# Altium project MMP8266.PrjPcb
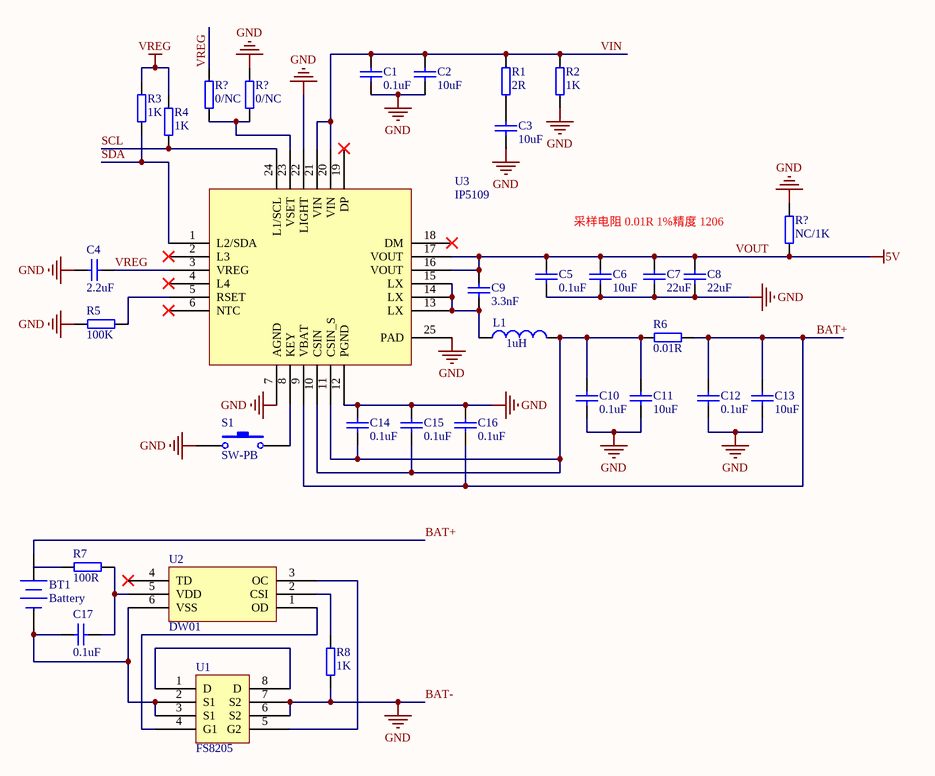
[diagram p0: MMP8266_PowerManage.SchDoc]
2 sheets, 34 parts. Net scope: global (net labels, ports and power ports of the same name join across sheets).
Board file: MMP8266.PcbDoc
Sheets:
  MMP8266_Core.SchDoc
  MMP8266_PowerManage.SchDoc

## Sheet MMP8266_Core.SchDoc
size A4

## Sheet MMP8266_PowerManage.SchDoc
size A4

### Parts
(Parts that share a designator on the sheet are numbered #1, #2 ... from top to bottom, then left to right.)
BT1  Battery  [BAT-2]
C1  0.1uF  [0603_C]
C2  10uF  [0603_C]
C3  10uF  [0603_C]
C4  2.2uF  [0603_C]
C5  0.1uF  [0603_C]
C6  10uF  [0603_C]
C7  22uF  [0603_C]
C8  22uF  [0603_C]
C9  3.3nF  [0603_C]
C10  0.1uF  [0603_C]
C11  10uF  [0603_C]
C12  0.1uF  [0603_C]
C13  10uF  [0603_C]
C14  0.1uF  [0603_C]
C15  0.1uF  [0603_C]
C16  0.1uF  [0603_C]
C17  0.1uF  [0603_C]
L1  value 1uH  [0402-A]  (hidden comment: ductor)
R1  2R  [0603_R]
R2  1K  [0603_R]
R3  1K  [0603_R]
R4  1K  [0603_R]
R5  100K  [0603_R]
R6  0.01R  [0805_R]
R7  100R  [0603_R]
R8  1K  [0603_R]
R?#1  0/NC  [0603_R]
R?#2  0/NC  [0603_R]
R?#3  NC/1K  [0603_R]
S1  SW-PB  [SPST-2]
U1  FS8205  [TSSOP-8_3X4.4X065P]
U2  DW01  [SOT-23-6]
U3  IP5109  [QFN24]

### Nets
BAT-: C1.2 C2.2 C3.2 C4.1 C5.2 C6.2 C7.2 C8.2 C10.2 C11.2 C12.2 C13.2 C14.1 C15.1 C16.1 R2.2 R5.1 R8.2 R?#2.1 R?#3.1 S1.1 U1.6(S2) U1.7(S2) U3.7(AGND) U3.12(PGND) U3.22(LIGHT) U3.25(PAD)  [also labelled GND]
VOUT: C5.1 C6.1 C7.1 C8.1 C9.1 R?#3.2 U3.16(VOUT) U3.17(VOUT)  [also labelled 5V]
VREG: C4.2 R3.1 R4.1 R?#1.1 U3.3(VREG)
BAT+: BT1.1(+) C12.1 C13.1 C16.2 R6.2 U3.9(VBAT)
SCL: R4.2 U3.24(L1/SCL)
SDA: R3.2 U3.1(L2/SDA)
VIN: C1.1 C2.1 R1.1 R2.1 U3.20(VIN) U3.21(VIN)
NetBT1_2: BT1.2(-) C17.1 U1.2(S1) U1.3(S1) U2.6(VSS)
NetC3_1: C3.1 R1.2
NetC9_2: C9.2 L1.1 U3.13(LX) U3.14(LX) U3.15(LX)
NetC10_1: C10.1 C11.1 C14.2 C15.2 L1.2 R6.1 U3.10(CSIN) U3.11(CSIN_S)
NetC17_2: C17.2 R7.1 U2.5(VDD)
NetR5_2: R5.2 U3.5(RSET)
NetR8_1: R8.1 U2.2(CSI)
NetR?#1_2: R?#1.2 R?#2.2 U3.23(VSET)
NetS1_2: S1.2 U3.8(KEY)
NetU1_1: U1.1(D) U1.8(D)
NetU1_4: U1.4(G1) U2.1(OD)
NetU1_5: U1.5(G2) U2.3(OC)

Not connected (* = marked no-connect by the designer): R7 2; U2 4(TD)*; U3 2(L3)* 4(L4)* 6(NTC)* 18(DM)* 19(DP)*

### Notes on the sheet
- 采样电阻 0.01R 1%精度 1206

### Library data of the parts
BT1 = Battery: Multicell Battery; Published: 24-Mar-1999; LatestRevisionDate: 17-Jul-2002; LatestRevisionNote: Re-released for DXP Platform.; PackageReference: BAT-2; Publisher: Altium Limited; PackageDescription: Battery; 2 Leads
C1-C17 = CAP
L1 = Inductor: Code_IEC: 1005; Published: 8-Jun-2000; LatestRevisionDate: 29-May-2009; LatestRevisionNote: IPC-7351 Footprint Added.; PackageReference: 0402-A; Publisher: Altium Limited; PackageDescription: Chip Inductor; Code_JEITA: 0402
R1-R5 R7 R8 R?#1-R?#3 = RES2
R6 = RES2: 1206规格 1%精度
S1 = SW-PB: Switch; Published: 24-Mar-1999; LatestRevisionDate: 17-Jul-2002; LatestRevisionNote: Re-released for DXP Platform.; PackageReference: SPST-2; Publisher: Altium Limited; PackageDescription: Switch; 2 Leads